# EAGLE design MultiWiiChassis_hexmini_power (EAGLE 6.4)
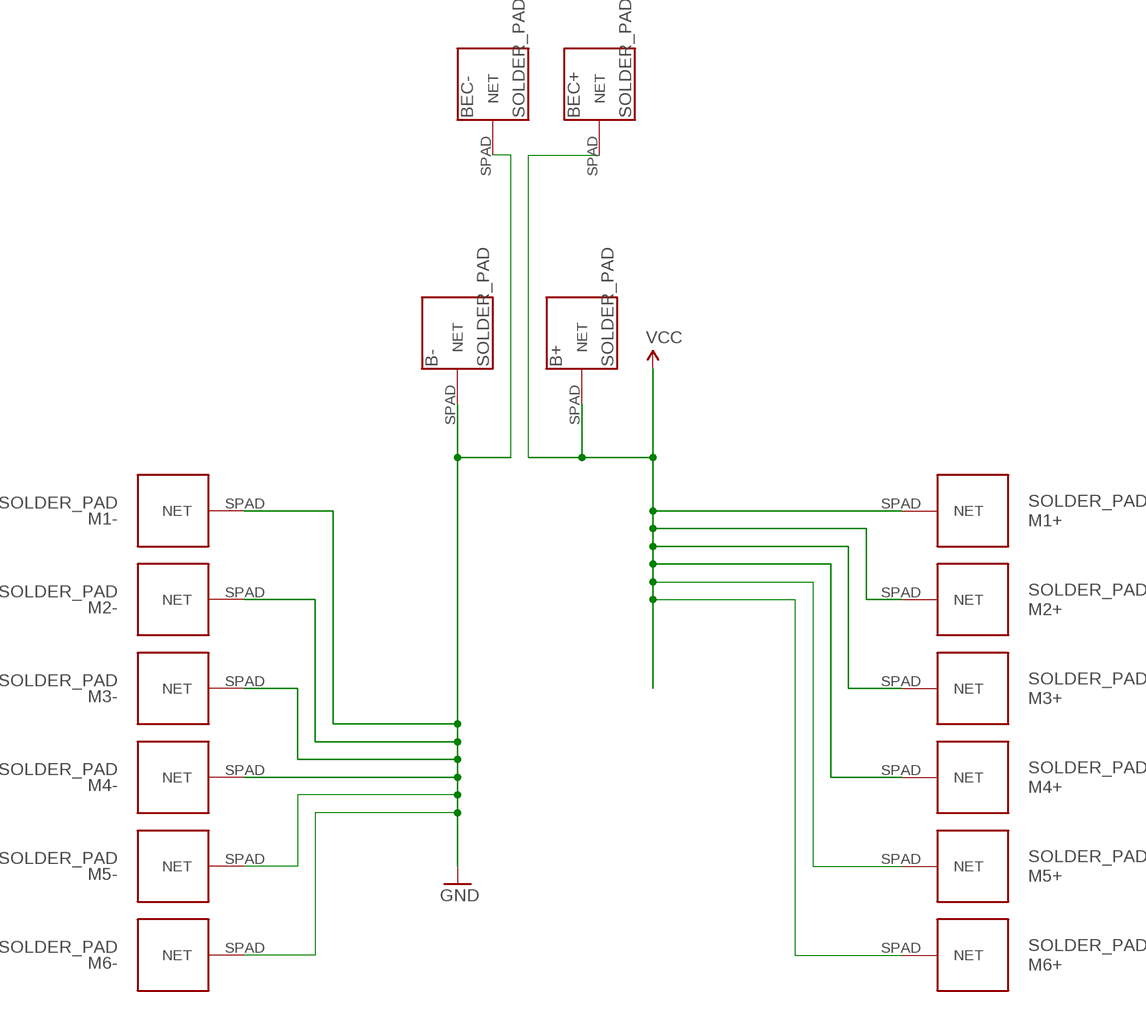
[diagram p0: schematic, sheet 1]

## Parts
B+  SOLDER_PAD  [SOLDER_PAD]
B-  SOLDER_PAD  [SOLDER_PAD]
BEC+  SOLDER_PAD  [SOLDER_PAD]
BEC-  SOLDER_PAD  [SOLDER_PAD]
M1+  SOLDER_PAD  [SOLDER_PAD]
M1-  SOLDER_PAD  [SOLDER_PAD]
M2+  SOLDER_PAD  [SOLDER_PAD]
M2-  SOLDER_PAD  [SOLDER_PAD]
M3+  SOLDER_PAD  [SOLDER_PAD]
M3-  SOLDER_PAD  [SOLDER_PAD]
M4+  SOLDER_PAD  [SOLDER_PAD]
M4-  SOLDER_PAD  [SOLDER_PAD]
M5+  SOLDER_PAD  [SOLDER_PAD]
M5-  SOLDER_PAD  [SOLDER_PAD]
M6+  SOLDER_PAD  [SOLDER_PAD]
M6-  SOLDER_PAD  [SOLDER_PAD]

## Nets
GND: B-.SPAD(NET) BEC-.SPAD(NET) M1-.SPAD(NET) M2-.SPAD(NET) M3-.SPAD(NET) M4-.SPAD(NET) M5-.SPAD(NET) M6-.SPAD(NET)
VCC: B+.SPAD(NET) BEC+.SPAD(NET) M1+.SPAD(NET) M2+.SPAD(NET) M3+.SPAD(NET) M4+.SPAD(NET) M5+.SPAD(NET) M6+.SPAD(NET)

## Library data of the parts
B+ B- BEC+ BEC- M1+ M1- M2+ M2- M3+ M3- M4+ M4- M5+ M5- M6+ M6- = JCM:SOLDER_PAD

## Board
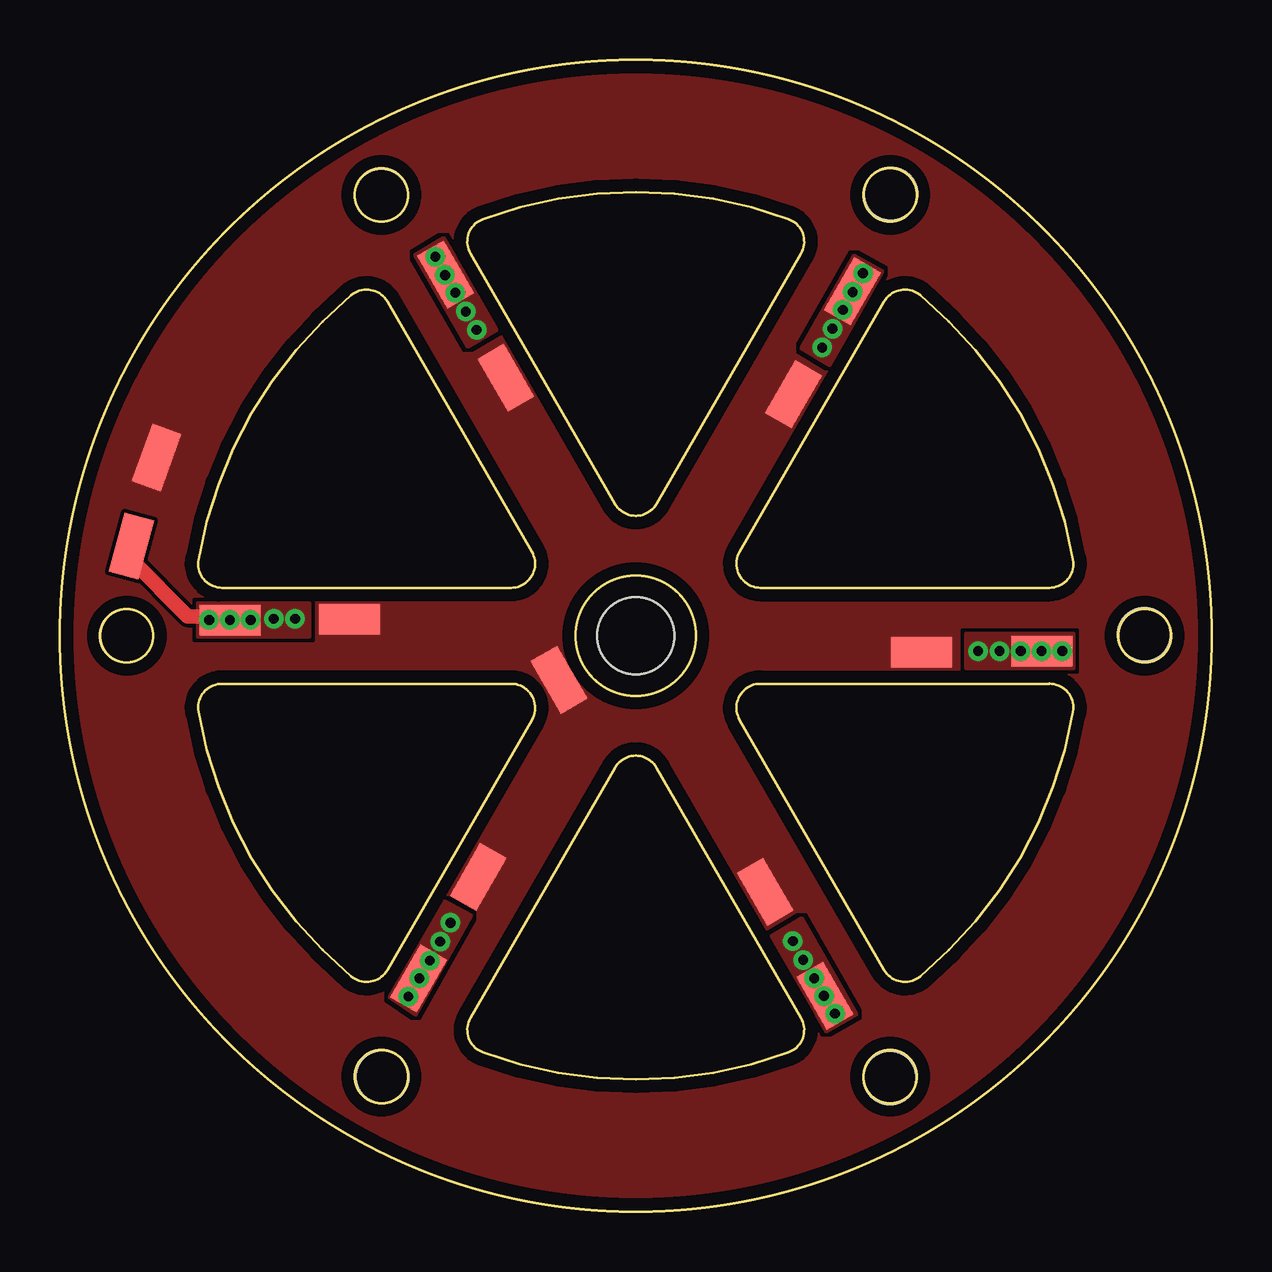
[diagram p1: board, top side]
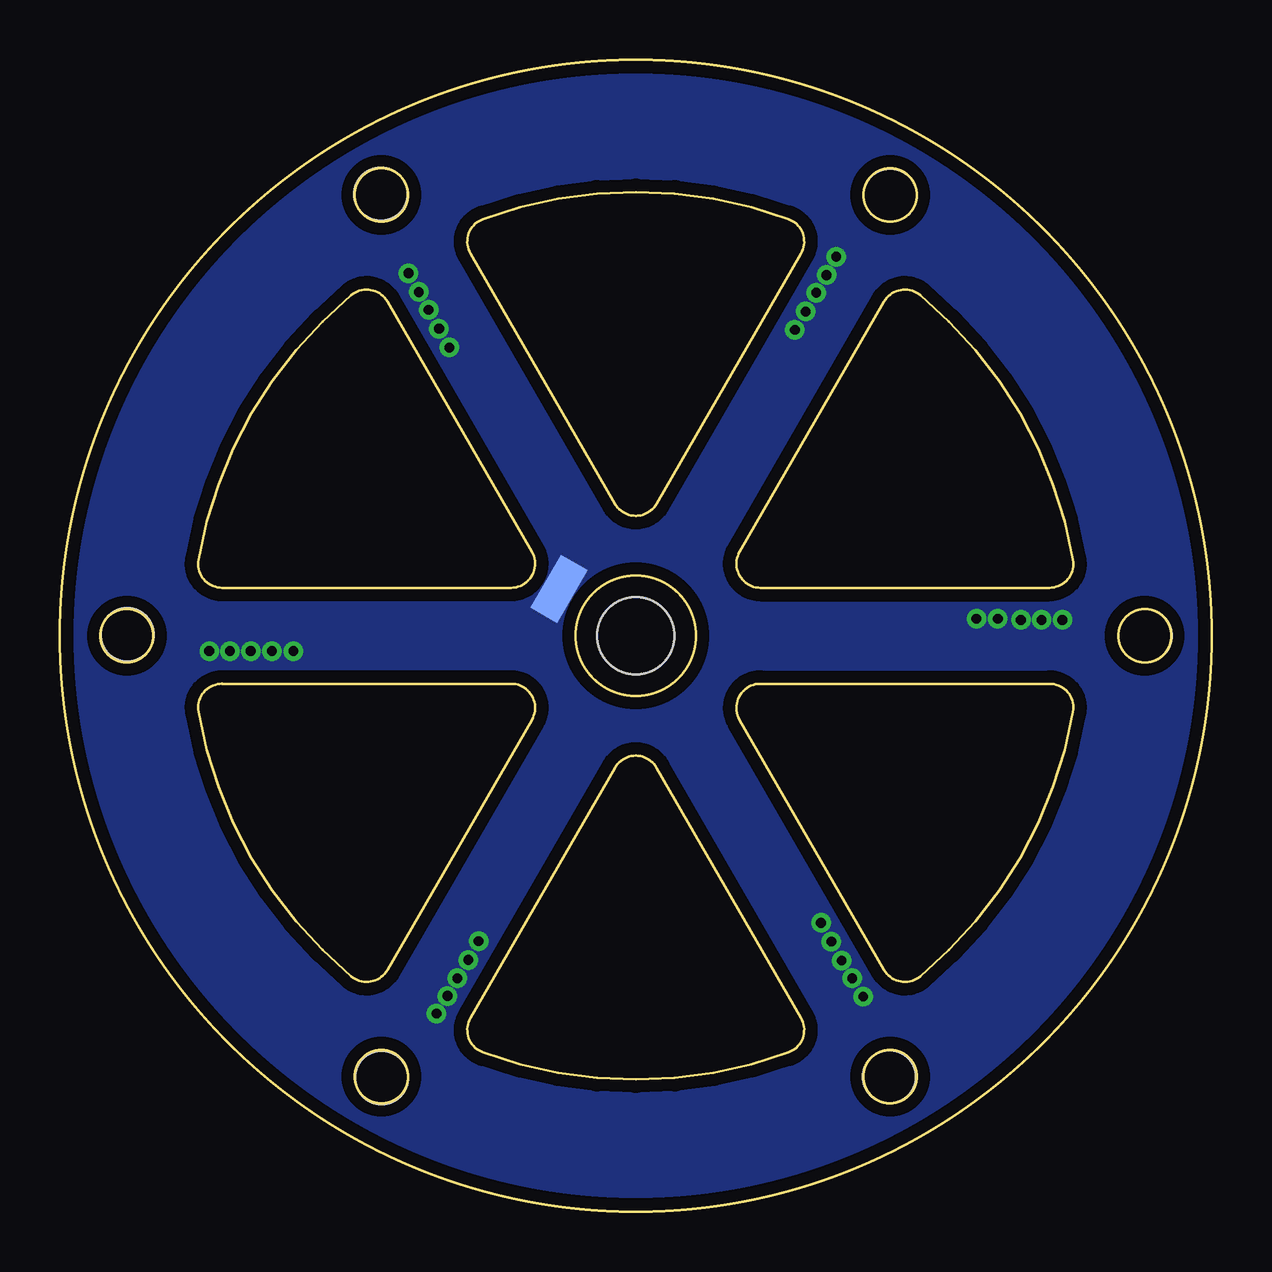
[diagram p2: board, bottom side, seen from below]

Size 48 x 48 mm. Coordinates in mm from the lower left corner, seen from the top.
Outline: 24.87,29.5 30.89,39.93 arc100 30.37,41.37 arc40 17.63,41.37 arc100 17.11,39.93 23.13,29.5 arc120 24.87,29.5
Outline: 29.2,26 41.24,26 arc100 42.23,27.17 arc40 35.86,38.2 arc100 34.35,37.93 28.33,27.5 arc120 29.2,26
Outline: 28.33,20.5 34.35,10.07 arc100 35.86,9.8 arc40 42.23,20.83 arc100 41.24,22 29.2,22 arc120 28.33,20.5
Outline: 23.13,18.5 17.11,8.07 arc100 17.63,6.63 arc40 30.37,6.63 arc100 30.89,8.07 24.87,18.5 arc120 23.13,18.5
Outline: 12.14,38.2 arc40 5.77,27.17 arc100 6.76,26 18.8,26 arc120 19.67,27.5 13.65,37.93 arc100 12.14,38.2
Outline: 18.8,22 6.76,22 arc100 5.77,20.83 arc40 12.14,9.8 arc100 13.65,10.07 19.67,20.5 arc120 18.8,22
Outline: circle at 24,24 radius 2.5
Outline: circle at 2.79,24 radius 1.1
Outline: circle at 13.39,42.37 radius 1.1
Outline: circle at 34.61,42.37 radius 1.1
Outline: circle at 45.21,24 radius 1.1
Outline: circle at 34.61,5.63 radius 1.1
Outline: circle at 13.39,5.63 radius 1.1
Outline: circle at 24,24 radius 24
Copper layers (1*16): Top 0.0178mm / dielectric 59mil / Bottom 0.0178mm
Design rules "SSC-EAGLE-2Lyr_v1.0.0.3-JCM": minimum track width 6mil, minimum drill 12mil, track to track 6mil, track to pad 6mil, pad to pad 6mil, via to via 6mil, smd to smd 6mil, copper to edge 20mil, drill to drill 16mil, minimum pad ring 8mil, minimum via ring 8mil, stop-mask expansion 3mil, vias tented up to drill 0mil, thermal gap 10mil
Holes 2.2 mm at 13.43,5.62 13.4,42.36 34.62,42.4 45.2,24.04 34.6,5.59 2.77,24
Holes 3.2 mm at 24,24
vRestrict: 3 lines

### Footprints (pad centres in the part's own frame; a part is rotated, then mirrored left to right if it is on the bottom)
SOLDER_PAD = smd 2.54 x 1.27: SPAD 0,0

### Placement (x,y rotation side)
B+  20.8,22.16 120 top
B-  27.2,25.95 240 bottom
BEC+  4.03,31.43 250 top
BEC-  2.98,27.74 255 top
M1+  18.58,34.75 300 top
M1-  16.07,39.06 120 top
M2+  12.07,24.68 0 top
M2-  7.09,24.65 0 top
M3+  35.9,23.31 0 top
M3-  40.92,23.36 0 top
M4+  30.57,34.07 240 top
M4-  33.04,38.36 60 top
M5+  17.44,13.95 240 top
M5-  14.95,9.72 240 top
M6+  29.4,13.32 120 top
M6-  31.89,9 120 top

### Tracks (layer width: path | path; a pad name or v marks a point on that pad's centre or on a via)
GND  (via drill 0.41)
  Top 0.61: BEC-.SPAD 2.98,27.16 5.33,24.81 6.93,24.81 M2-.SPAD
  other vias: 6.22,24.66 7.08,24.66 7.95,24.66 8.91,24.71 9.8,24.71 14.52,8.96 14.98,9.72 15.41,10.46 32.3,8.25 31.85,8.99 31.44,9.72 41.78,23.36 40.91,23.36 40.05,23.36 33.47,39.11 33.04,38.32 32.63,37.59 16.48,38.3 16.05,39.04 15.64,39.8 16.91,37.51 17.37,36.75 32.2,36.8 31.77,36.01 39.16,23.36 38.27,23.36 30.98,10.49 30.55,11.27 15.84,11.25 16.28,12.04
  pour Bottom (isolate 0.406, no thermals): -14.66,62.25 60.03,62.62 59.83,-13.62 -14.76,-14.05
  pour Top (no thermals): 13.74,8.96 16.02,12.95 17.17,12.34 14.83,8.17 13.71,8.94
  pour Top (no thermals): 5.74,25.37 5.74,23.95 10.41,23.95 10.41,25.37
  pour Top (no thermals): 14.78,39.87 16.99,36.04 18.26,36.77 16,40.58
  pour Top (no thermals): 33.09,39.87 30.88,35.99 32.1,35.25 34.31,39.19
  pour Top (no thermals): 42.26,24.1 42.26,22.63 37.77,22.63 37.77,24.1
  pour Top (no thermals): 31.95,7.49 29.64,11.48 30.93,12.24 33.22,8.23
VCC
  pour Top (rank 2, no thermals): 60.12,62.2 60.03,-14.1 -15.37,-14.2 -15.27,62.1

### Text on the board
tDocu: + | - | MultiWiiChassis | J Moreland | HEXPower v2 | Engineering / LLC